# Altium project BEE-1012 PAY-IF V110.PrjPcb (part 6 of 8)

## Sheet USB_SWITCH.SchDoc
size 420 x 297 mm; SheetNumber: 16; SheetTotal: 32
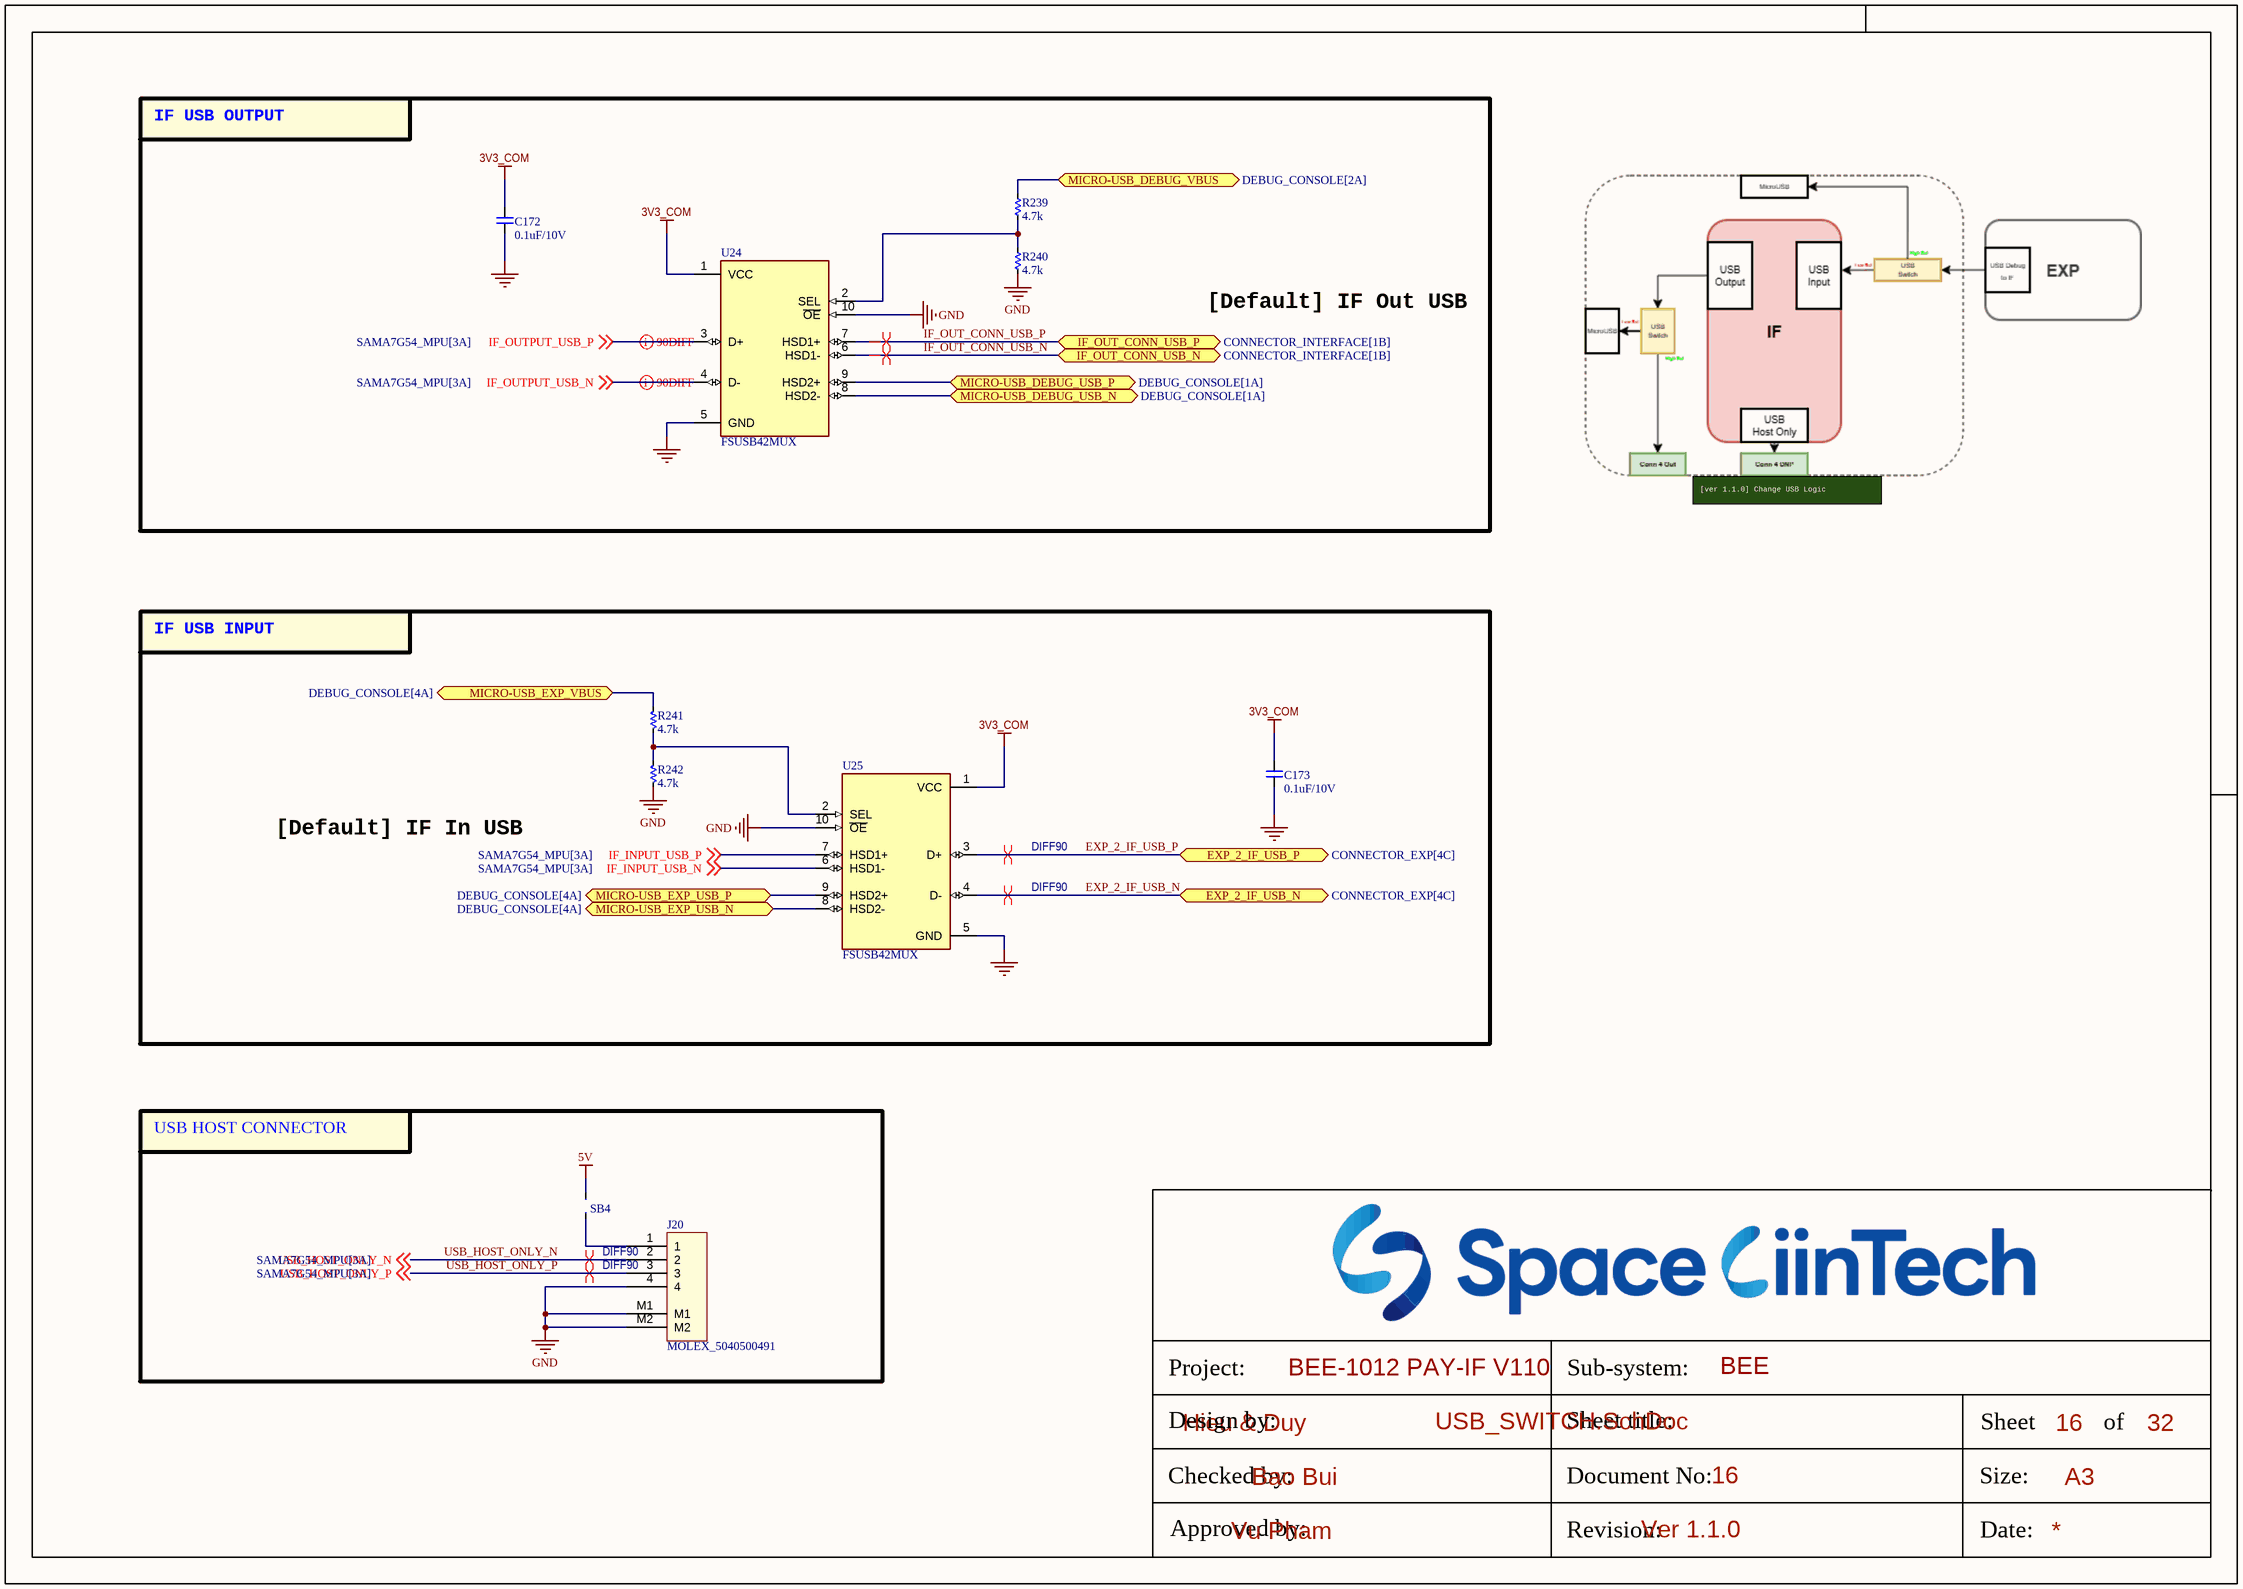
[diagram p17: USB_SWITCH.SchDoc]

### Parts
C172  0.1uF/10V  [CAP_C_1005X50_L]
C173  0.1uF/10V  [CAP_C_1005X50_L]
J20  MOLEX_5040500491  [MOLEX_5040500491]
R239  4.7k  [RES_C_1005x30_L]
R240  4.7k  [RES_C_1005x30_L]
R241  4.7k  [RES_C_1005x30_L]
R242  4.7k  [RES_C_1005x30_L]
SB4  JUMPER  [JUMPER_1608]  (value not drawn)
U24  FSUSB42MUX  [SOP50P490X110-10N]
U25  FSUSB42MUX  [SOP50P490X110-10N]

### Blocks framed on the sheet
[Default] IF Out USB: C172 R239 R240 U24
[Default] IF In USB: C173 R241 R242 U25
USB HOST CONNECTOR: J20 SB4

### Ports
EXP_2_IF_USB_N (bidir, see CONNECTOR_EXP[4C]), EXP_2_IF_USB_P (bidir, see CONNECTOR_EXP[4C]), IF_OUT_CONN_USB_N (bidir, see CONNECTOR_INTERFACE[1B]), IF_OUT_CONN_USB_P (bidir, see CONNECTOR_INTERFACE[1B]), MICRO-USB_DEBUG_USB_N (bidir, see DEBUG_CONSOLE[1A]), MICRO-USB_DEBUG_USB_P (bidir, see DEBUG_CONSOLE[1A]), MICRO-USB_DEBUG_VBUS (bidir, see DEBUG_CONSOLE[2A]), MICRO-USB_EXP_USB_N (bidir, see DEBUG_CONSOLE[4A]), MICRO-USB_EXP_USB_P (bidir, see DEBUG_CONSOLE[4A]), MICRO-USB_EXP_VBUS (bidir, see DEBUG_CONSOLE[4A])

### Nets
3V3_COM: C172.2 C173.2 U24.1(VCC) U25.1(VCC)
5V: SB4.1
GND: C172.1 C173.1 J20.4 J20.M1 J20.M2 R240.2 R242.2 U24.5(GND) U24.10(~{OE}) U25.5(GND) U25.10(~{OE})
EXP_2_IF_USB_N: U25.4(D-) ; port EXP_2_IF_USB_N
EXP_2_IF_USB_P: U25.3(D+) ; port EXP_2_IF_USB_P
IF_INPUT_USB_N: U25.6(HSD1-) ; off-sheet IF_INPUT_USB_N  [project net USBB_N]
IF_INPUT_USB_P: U25.7(HSD1+) ; off-sheet IF_INPUT_USB_P  [project net USBB_P]
IF_OUT_CONN_USB_N: U24.6(HSD1-) ; port IF_OUT_CONN_USB_N
IF_OUT_CONN_USB_P: U24.7(HSD1+) ; port IF_OUT_CONN_USB_P
IF_OUTPUT_USB_N: U24.4(D-) ; off-sheet IF_OUTPUT_USB_N  [project net USBA_N]
IF_OUTPUT_USB_P: U24.3(D+) ; off-sheet IF_OUTPUT_USB_P  [project net USBA_P]
USB_DEBUG_N: U24.8(HSD2-) ; port MICRO-USB_DEBUG_USB_N
USB_DEBUG_P: U24.9(HSD2+) ; port MICRO-USB_DEBUG_USB_P
USB_EXP_N: U25.8(HSD2-) ; port MICRO-USB_EXP_USB_N
USB_EXP_P: U25.9(HSD2+) ; port MICRO-USB_EXP_USB_P
USB_HOST_ONLY_N: J20.2 ; off-sheet USB_HOST_ONLY_N
USB_HOST_ONLY_P: J20.3 ; off-sheet USB_HOST_ONLY_P
VBUS_DEBUG: R239.1 ; port MICRO-USB_DEBUG_VBUS
VBUS_EXP: R241.1 ; port MICRO-USB_EXP_VBUS
NetJ20_1: J20.1 SB4.2
NetR239_2: R239.2 R240.1 U24.2(SEL)
NetR241_2: R241.2 R242.1 U25.2(SEL)

### Layout directives
differential pair; differential pair class DIFF90; net class DIFF90: USBA_N, USBA_P
differential pair; differential pair class DIFF90; net class DIFF90; rule Matched Net Lengths [Tolerance = 4mil]: EXP_2_IF_USB_N, EXP_2_IF_USB_P, IF_OUT_CONN_USB_N, IF_OUT_CONN_USB_P, USB_HOST_ONLY_N, USB_HOST_ONLY_P

### Notes on the sheet
- IF USB OUTPUT
- [ver 1.1.0] Change USB Logic
- IF USB INPUT
- Project:
- Sub-system:
- Design by:
- Sheet title:
- Sheet
- A3
- of
- Checked by:
- Approved by:
- Revision:
- Document No:
- Size:
- Date:

### Library data of the parts
C172 C173 = _CAP_C_2: CAP
J20 = Header 4x1_2M
R239-R242 = _RES_B_2: RES
U24 U25 = FSUSB42MUX: FSUSB42 Series DPDT 4.3 V 480 Mbps SMT Hi Speed USB 2.0 Switch - MSOP-10; MF: ON Semiconductor; SnapEDA_Link: https://www.snapeda.com/parts/FSUSB42MUX/Onsemi/view-part/?ref=snap; Package: MSOP-10 ON Semiconductor; Value: *; MP: FSUSB42MUX; Check_prices: https://www.snapeda.com/parts/FSUSB42MUX/Onsemi/view-part/?ref=eda

## Sheet DEBUG_CONSOLE.SchDoc
size 420 x 297 mm; SheetNumber: 17; SheetTotal: 32
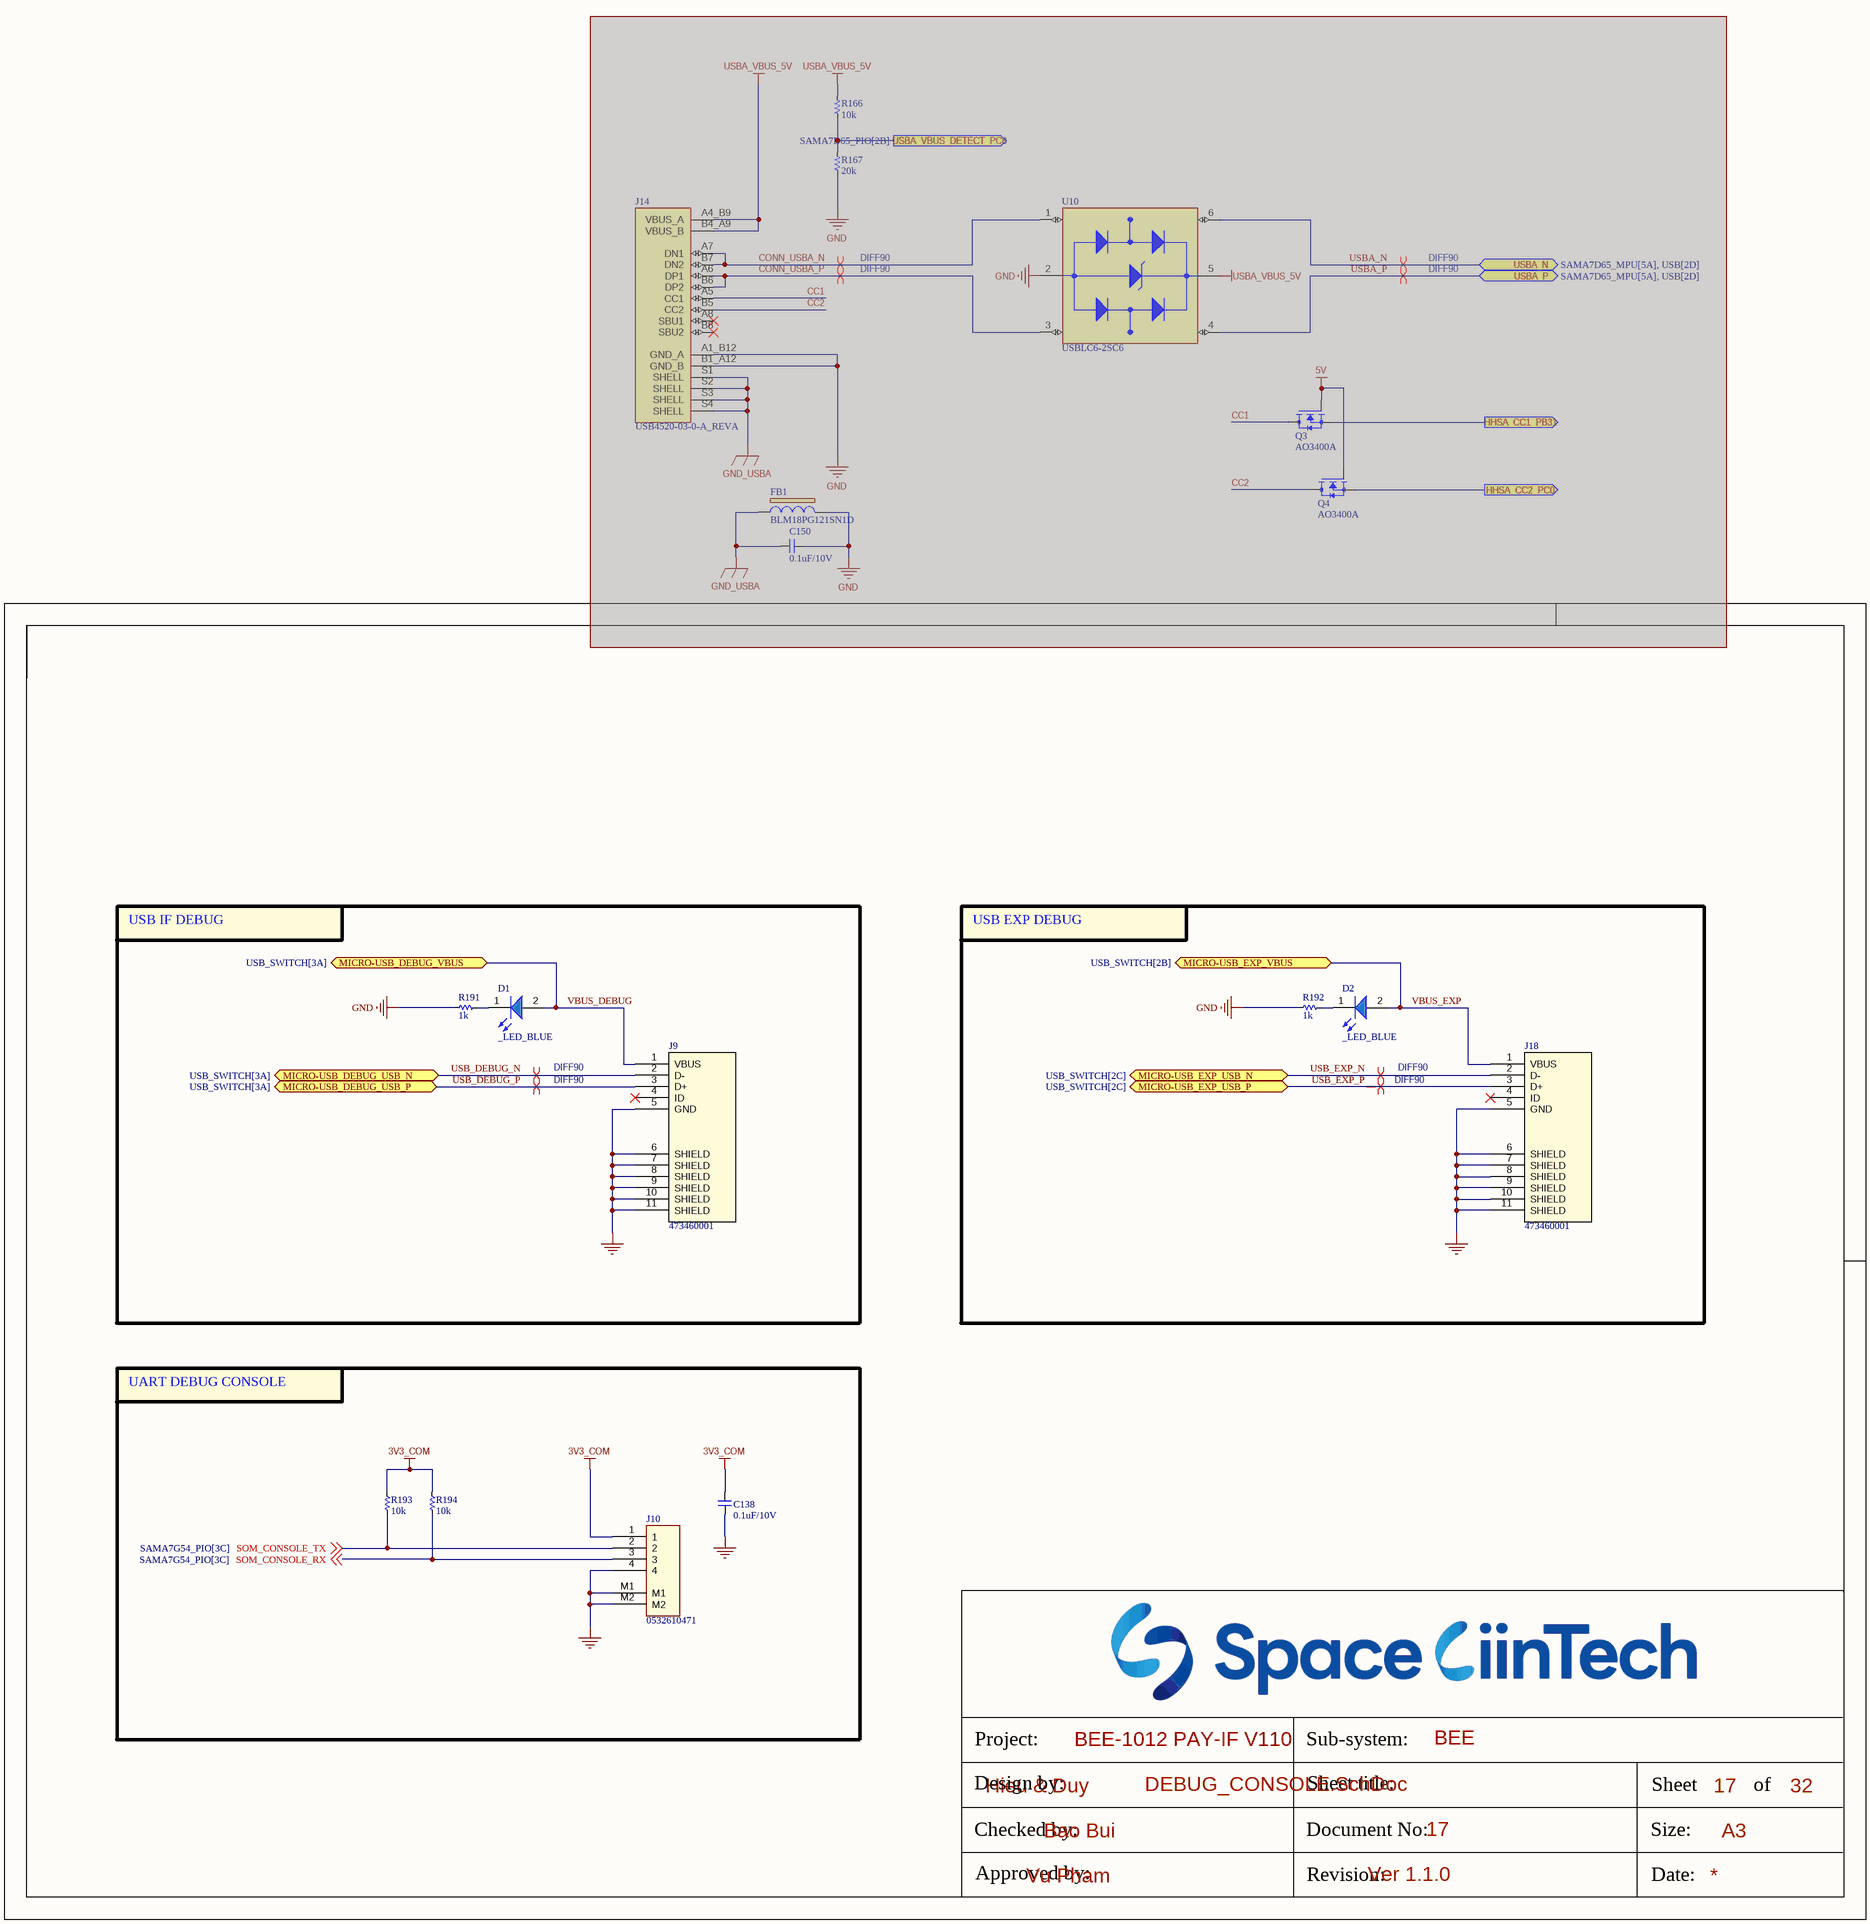
[diagram p18: DEBUG_CONSOLE.SchDoc]

### Parts
(Parts that share a designator on the sheet are numbered #1, #2 ... from top to bottom, then left to right.)
C138  0.1uF/10V  [CAP_C_1005X50_L]
C150#1  0.1uF/10V  [CAP_C_1005X50_L]  (masked out: inside a compile mask, not in the netlist)
D1  _LED_BLUE  [LED_0603]
D2  _LED_BLUE  [LED_0603]
FB1#1  BLM18PG121SN1D  [IND_BLM18_0603_MUR]  (masked out: inside a compile mask, not in the netlist)
J9  473460001  [47346-0001_MOL]
J10  0532610471  [MOLEX_0532610471]
J14#2  USB4520-03-0-A_REVA  [GCT_USB4520-03-0-A_REVA]  (masked out: inside a compile mask, not in the netlist)
J18  473460001  [47346-0001_MOL]
Q3#1  AO3400A  [SOT95P280X125-3N]  (masked out: inside a compile mask, not in the netlist)
Q4#1  AO3400A  [SOT95P280X125-3N]  (masked out: inside a compile mask, not in the netlist)
R166#2  10k  [RES_C_1005x30_L]  (masked out: inside a compile mask, not in the netlist)
R167#2  20k  [RES_C_0603X30]  (masked out: inside a compile mask, not in the netlist)
R191  1k  [RES_C_1005x30_L]
R192  1k  [RES_C_1005x30_L]
R193  10k  [RES_C_1005x30_L]
R194  10k  [RES_C_1005x30_L]
U10#2  USBLC6-2SC6  [SOT95P280X145-6N]  (masked out: inside a compile mask, not in the netlist)

### Blocks framed on the sheet
USB IF DEBUG: D1 J9 R191
USB EXP DEBUG: D2 J18 R192
UART DEBUG CONSOLE: C138 J10 R193 R194

### Ports
HHSA_CC1_PB31 (out), HHSA_CC2_PC0 (out), MICRO-USB_DEBUG_USB_N (bidir, see USB_SWITCH[3A]), MICRO-USB_DEBUG_USB_P (bidir, see USB_SWITCH[3A]), MICRO-USB_DEBUG_VBUS (bidir, see USB_SWITCH[3A]), MICRO-USB_EXP_USB_N (bidir, see USB_SWITCH[2C]), MICRO-USB_EXP_USB_P (bidir, see USB_SWITCH[2C]), MICRO-USB_EXP_VBUS (bidir, see USB_SWITCH[2B]), USBA_N (bidir, see SAMA7D65_MPU[5A], USB[2D]), USBA_P (bidir, see SAMA7D65_MPU[5A], USB[2D]), USBA_VBUS_DETECT_PC8 (out, see SAMA7D65_PIO[2B])

### Nets
3V3_COM: C138.2 J10.1 R193.1 R194.1
GND: C138.1 J9.5(GND) J9.6(SHIELD) J9.7(SHIELD) J9.8(SHIELD) J9.9(SHIELD) J9.10(SHIELD) J9.11(SHIELD) J10.4 J10.M1 J10.M2 J18.5(GND) J18.6(SHIELD) J18.7(SHIELD) J18.8(SHIELD) J18.9(SHIELD) J18.10(SHIELD) J18.11(SHIELD) R191.1 R192.1
SOM_CONSOLE_RX: J10.3 R194.2 ; off-sheet SOM_CONSOLE_RX
SOM_CONSOLE_TX: J10.2 R193.2 ; off-sheet SOM_CONSOLE_TX
USB_DEBUG_N: J9.2(D-) ; port MICRO-USB_DEBUG_USB_N
USB_DEBUG_P: J9.3(D+) ; port MICRO-USB_DEBUG_USB_P
USB_EXP_N: J18.2(D-) ; port MICRO-USB_EXP_USB_N
USB_EXP_P: J18.3(D+) ; port MICRO-USB_EXP_USB_P
VBUS_DEBUG: D1.2(A) J9.1(VBUS) ; port MICRO-USB_DEBUG_VBUS
VBUS_EXP: D2.2(A) J18.1(VBUS) ; port MICRO-USB_EXP_VBUS
NetD1_1: D1.1(K) R191.2
NetD2_1: D2.1(K) R192.2

Not connected (* = marked no-connect by the designer): J9 4(ID)*; J18 4(ID)*

### Layout directives
differential pair; differential pair class DIFF90; net class DIFF90; rule Matched Net Lengths [Tolerance = 4mil]: (no net found under the mark), USB_DEBUG_N, USB_DEBUG_P, USB_EXP_N, USB_EXP_P

### Notes on the sheet
- Project:
- Sub-system:
- Design by:
- Sheet title:
- Sheet
- A3
- of
- Checked by:
- Approved by:
- Revision:
- Document No:
- Size:
- Date:

### Library data of the parts
C138 C150#1 = _CAP_C_2: CAP
D1 D2 = LED_BLUE: LED BLUE CLEAR 0603 SMD
FB1#1 = BLM18PG121SN1D: FERRITE BEAD 120 OHM 0603 1LN; Manufacturer_Name: Murata; Copyright: Copyright (C) 2025 Ultra Librarian. All rights reserved.; Manufacturer_Part_Number: BLM18PG121SN1D
J9 J18 = 473460001: Micro-USB B Receptacle with Flange, Bottom Mount, Surface Mount, Lead-Free; Manufacturer_Name: Molex Connector Corporation; Copyright: Copyright (C) 2025 Ultra Librarian. All rights reserved.; Manufacturer_Part_Number: 473460001; RefDes: RefDes; Type: Type
J10 = Header 4x1_2M
J14#2 = USB4520-03-0-A_REVA: USB-C (USB TYPE-C) USB 2.0 Receptacle Connector 24 (16+8 Dummy) Position Board Edge, Cutout; Surface Mount; Through Hole, Right Angle; MF: Global Connector Technology; SnapEDA_Link: https://www.snapeda.com/parts/USB4520-03-0-A/Global+Connector+Technology/view-part/?ref=snap; Package: None; Value: *; MP: USB4520-03-0-A; Check_prices: https://www.snapeda.com/parts/USB4520-03-0-A/Global+Connector+Technology/view-part/?ref=eda
Q3#1 Q4#1 = AO3400A: N-Channel 30 V 5.7A (Ta) 1.4W (Ta) Surface Mount SOT-23-3; MF: Alpha & Omega Semiconductor; SnapEDA_Link: https://www.snapeda.com/parts/AO3400A/Alpha/view-part/?ref=snap; Package: SOT-23 Alpha &amp; Omega Semiconductor Inc.; Value: *; MP: AO3400A; Check_prices: https://www.snapeda.com/parts/AO3400A/Alpha/view-part/?ref=eda
R166#2 R167#2 R191-R194 = _RES_B_2: RES
U10#2 = USBLC6-2SC6: 17V Clamp 5A (8/20Âµs) Ipp Tvs Diode Surface Mount SOT-23-6; MF: STMicroelectronics; Value: *; SnapEDA_Link: https://www.snapeda.com/parts/USBLC6-2SC6/STMicroelectronics/view-part/?ref=snap; Check_prices: https://www.snapeda.com/parts/USBLC6-2SC6/STMicroelectronics/view-part/?ref=eda; Purchase-URL: https://pricing.snapeda.com/search/part/USBLC6-2SC6/?ref=eda; Price: None; Availability: In Stock; Package: SOT-23-6 STMicroelectronics; MP: USBLC6-2SC6